# EAGLE schematic control_board (EAGLE 9.6.2)
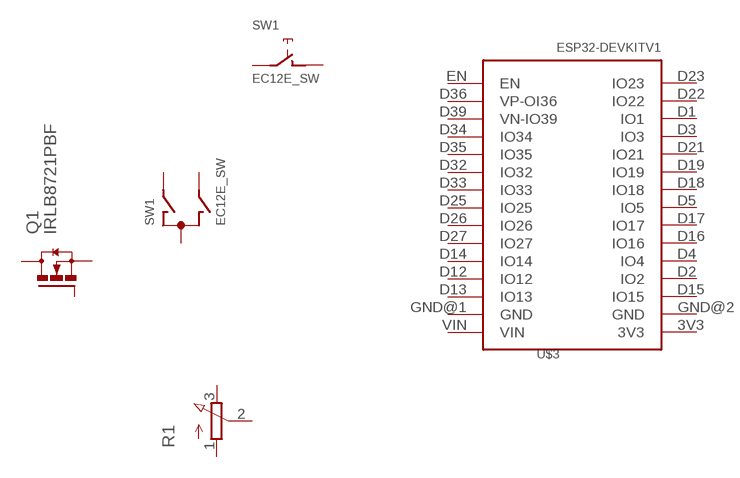
[diagram p0: schematic, sheet 1]

## Parts
Q1  IRLB8721PBF  [TO220BV]
R1  3RP/1610N  [3RP/1610N]
SW1  EC12E_SW  [ALPS_EC12E_SW]
U$1  IRLB8721PBF  [TO220BV]  (not placed on a sheet)
U$2  IRLB8721PBF  [TO220BV]  (not placed on a sheet)
U$3  ESP32DEVKITV1  [ESP32-DEVKITV1]
Unconnected: Q1.D Q1.G Q1.S R1.1(A) R1.2(S) R1.3(E) SW1.A SW1.B SW1.C SW1.D SW1.E SW1.GND1(G) SW1.GND2(G) U$1.D U$1.G U$1.S U$2.D U$2.G U$2.S U$3.3V3 U$3.D1(IO1) U$3.D2(IO2) U$3.D3(IO3) U$3.D4(IO4) U$3.D5(IO5) U$3.D12(IO12) U$3.D13(IO13) U$3.D14(IO14) U$3.D15(IO15) U$3.D16(IO16) U$3.D17(IO17) U$3.D18(IO18) U$3.D19(IO19) U$3.D21(IO21) U$3.D22(IO22) U$3.D23(IO23) U$3.D25(IO25) U$3.D26(IO26) U$3.D27(IO27) U$3.D32(IO32) U$3.D33(IO33) U$3.D34(IO34) U$3.D35(IO35) U$3.D36(VP-OI36) U$3.D39(VN-IO39) U$3.EN U$3.GND@1(GND) U$3.GND@2(GND) U$3.VIN

## Library data of the parts
Q1 U$1 U$2 = drue_custom:IRLB8721PBF
R1 = pot:3RP/1610N: 16mm Potentiometer one level Source: http://www.alphapotentiometers.net/html/16mm_pot_2.html
SW1 = switch-alps:EC12E_SW: ALPS rotary Encoder EC12E series with switch; MPN: EC12E2424407; OC_FARNELL: 1520813; OC_NEWARK: 74M1068
U$3 = ESP32-DEVKITV1:ESP32DEVKITV1